# Altium schematic sheet Relay_Latches.SchDoc
size A3; SheetNumber: 3; SheetTotal: 5
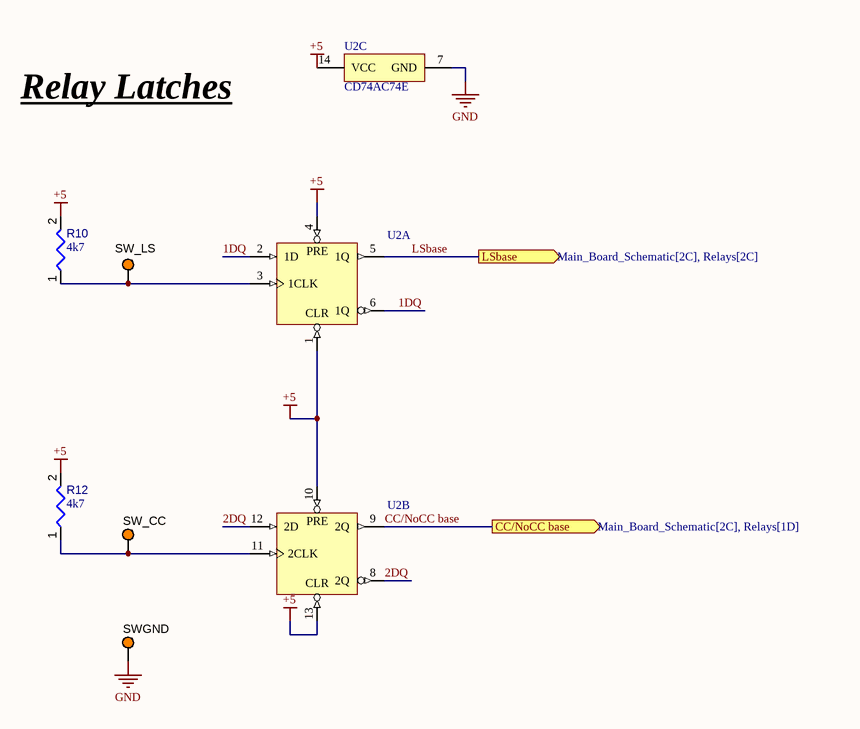
[diagram p0: Relay_Latches.SchDoc]

## Parts
R10  value 4k7  [RESA60-630X240]  (hidden comment: MFR-25FBF52-100R)
R12  value 4k7  [RESA60-630X240]  (hidden comment: MFR-25FBF52-100R)
SW_CC  5003  [KSTN-5003]  (value not drawn)
SW_LS  5003  [KSTN-5003]  (value not drawn)
SWGND  5003  [KSTN-5003]  (value not drawn)
U2  CD74AC74E  [N0014A]  (value not drawn)  (parts A,B,C of 3)

## Ports
CC/NoCC base (out, see Main_Board_Schematic[2C], Relays[1D]), LSbase (out, see Main_Board_Schematic[2C], Relays[2C])

## Nets
+5: R10.2 R12.2 U2.1(1~{CLR}) U2.4(1~{PRE}) U2.10(2~{PRE}) U2.13(2~{CLR}) U2.14(VCC)
GND: SWGND.1 U2.7(GND)
1DQ: U2.2(1D) U2.6(1Q)
2DQ: U2.8(2Q) U2.12(2D)
CC/NoCC base: U2.9(2Q) ; port CC/NoCC base
LSbase: U2.5(1Q) ; port LSbase
NetR10_1: R10.1 SW_LS.1 U2.3(1CLK)
NetR12_1: R12.1 SW_CC.1 U2.11(2CLK)

## Notes on the sheet
- Relay Latches
- (in symbol CMP-1619-00741-2, part A) PRE; CLR
- (in symbol CMP-1619-00741-2, part B) PRE; CLR

## Library data of the parts
R10 R12 = CMP-009-00046-4: Axial Resistor, 100 Ohm, +/- 1%, 0.25 W, -55 to 155 degC, 2-Pin THD, RoHS, Bulk; Manufacturer: Yageo; Voltage Rating: 250V; Power: 250mW; Packaging: Bulk; Max Operating Temperature: 155°C; Mounting Technology: TH; Datasheet Version: Apr-13; Case/Package: Axial; RoHS Compliant: True; Package Description: 2-Pin Axial Lead, Dia 2.4 mm, Body Length 6.3 mm; Package Quantity: 200; Package Reference: MFR-25; Tolerance: 1%; Composition: CarbonFilm; Datasheet URL: http://www.yageo.com/documents/recent/Yageo%20LR_MFR_2013.pdf; Manufacturer URL: http://www.yageo.com/; Min Operating Temperature: -55°C
SW_CC SW_LS SWGND = CMP-002-00037-2: Test Point, Orange, Height 4.6 mm, Tail Length 3 mm, 1-Pin THD, RoHS; Manufacturer: Keystone; Colour: Orange; Packaging: Bulk; Package Description: 1-Pin Through Hole Device, Dia 2.54 mm; Pins: 1; Package Reference: 5003; Datasheet Version: Jun-15; Case/Package: 5003; Mounting Technology: TH; Connector Type: TestPoint; Diameter: 2.54mm; Contact Material: Bronze; Datasheet URL: http://keyelco.com/userAssets/file/M65p56.pdf; Manufacturer URL: http://www.keyelco.com/; Package Quantity: 10; Contact Plating: Tin; RoHS Compliant: True
U2 = CMP-1619-00741-2: Dual Positive-Edge-Triggered D-Type Flip-Flops with Set and Reset, N0014A, TUBE; Manufacturer: Texas Instruments; VCC(Min)(V): 1.5; Rating: Catalog; Voltage(Nom)(V): 1.5,3.3,5; VCC(Max)(V): 5.5; Technology Family: AC; Input Type: CMOS; ICC @ Nom Voltage(Max)(mA): 0.04; Schmitt Trigger: No; F @ Nom Voltage(Max)(Mhz): 100; Output Drive (IOL/IOH)(Max)(mA): 24/-24; Output Logic: Inverted,Non-inverted; tpd @ Nom Voltage(Max)(ns): 114,12.7,9.1; Bits(#): 2; Generic Part Number: CD74AC74; Operating Temperature Range(C): -55 to 125; Code_JEDEC: MS-001; 3-State Output: No; PackageReference: N0014A; DatasheetVersion: SCHS231D; Output Type: CMOS